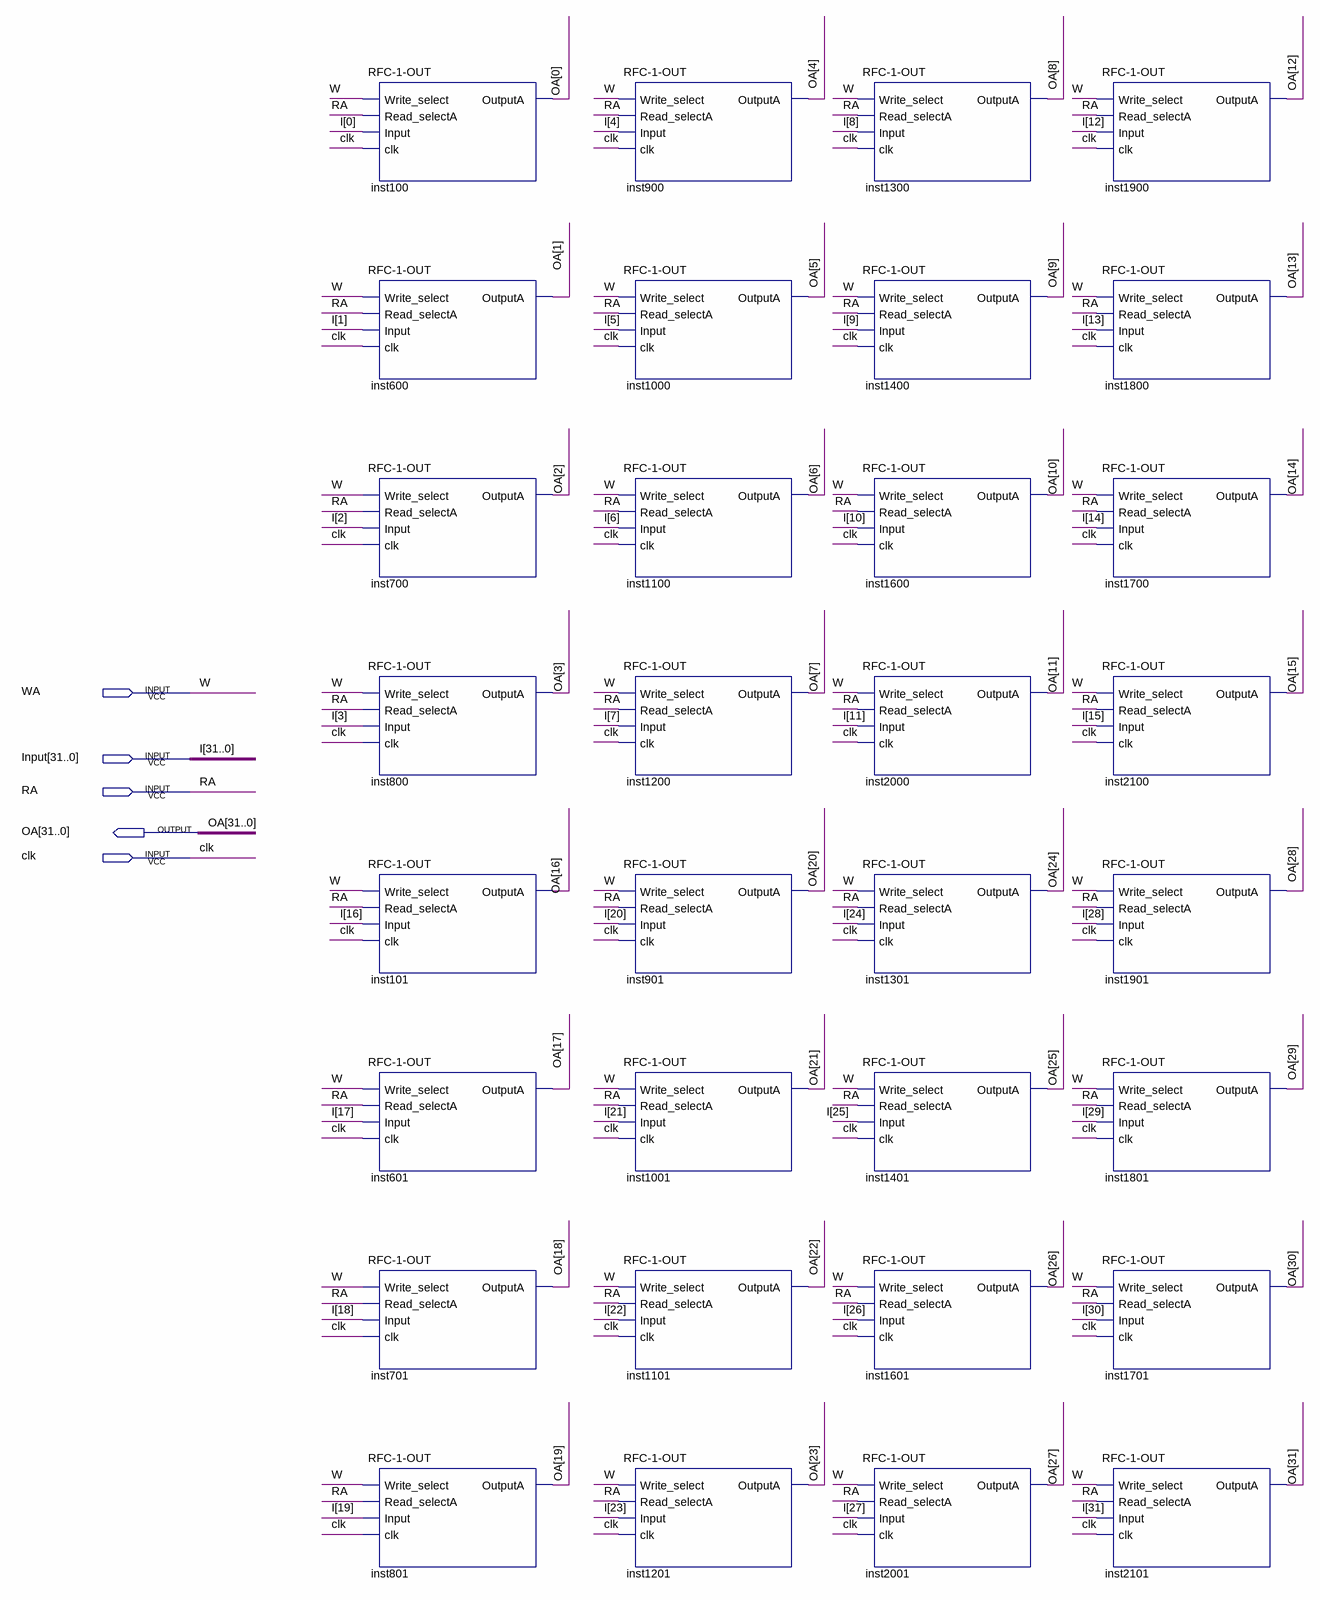
[diagram p0: schematic sheet]
// Quartus schematic RFC-1-OUT-32bits.bdf as structural Verilog: 32 symbols, 5 pins
module \RFC-1-OUT-32bits  (
  input  WA,
  input  [31:0] Input,
  input  RA,
  input  clk,
  output [31:0] OA
);

  \RFC-1-OUT  inst100 (.Write_select(WA), .Read_selectA(RA), .Input(Input[0]), .clk(clk), .OutputA(OA[0]));
  \RFC-1-OUT  inst600 (.Write_select(WA), .Read_selectA(RA), .Input(Input[1]), .clk(clk), .OutputA(OA[1]));
  \RFC-1-OUT  inst700 (.Write_select(WA), .Read_selectA(RA), .Input(Input[2]), .clk(clk), .OutputA(OA[2]));
  \RFC-1-OUT  inst800 (.Write_select(WA), .Read_selectA(RA), .Input(Input[3]), .clk(clk), .OutputA(OA[3]));
  \RFC-1-OUT  inst101 (.Write_select(WA), .Read_selectA(RA), .Input(Input[16]), .clk(clk), .OutputA(OA[16]));
  \RFC-1-OUT  inst601 (.Write_select(WA), .Read_selectA(RA), .Input(Input[17]), .clk(clk), .OutputA(OA[17]));
  \RFC-1-OUT  inst701 (.Write_select(WA), .Read_selectA(RA), .Input(Input[18]), .clk(clk), .OutputA(OA[18]));
  \RFC-1-OUT  inst801 (.Write_select(WA), .Read_selectA(RA), .Input(Input[19]), .clk(clk), .OutputA(OA[19]));
  \RFC-1-OUT  inst900 (.Write_select(WA), .Read_selectA(RA), .Input(Input[4]), .clk(clk), .OutputA(OA[4]));
  \RFC-1-OUT  inst1000 (.Write_select(WA), .Read_selectA(RA), .Input(Input[5]), .clk(clk), .OutputA(OA[5]));
  \RFC-1-OUT  inst1100 (.Write_select(WA), .Read_selectA(RA), .Input(Input[6]), .clk(clk), .OutputA(OA[6]));
  \RFC-1-OUT  inst1200 (.Write_select(WA), .Read_selectA(RA), .Input(Input[7]), .clk(clk), .OutputA(OA[7]));
  \RFC-1-OUT  inst901 (.Write_select(WA), .Read_selectA(RA), .Input(Input[20]), .clk(clk), .OutputA(OA[20]));
  \RFC-1-OUT  inst1001 (.Write_select(WA), .Read_selectA(RA), .Input(Input[21]), .clk(clk), .OutputA(OA[21]));
  \RFC-1-OUT  inst1101 (.Write_select(WA), .Read_selectA(RA), .Input(Input[22]), .clk(clk), .OutputA(OA[22]));
  \RFC-1-OUT  inst1201 (.Write_select(WA), .Read_selectA(RA), .Input(Input[23]), .clk(clk), .OutputA(OA[23]));
  \RFC-1-OUT  inst1300 (.Write_select(WA), .Read_selectA(RA), .Input(Input[8]), .clk(clk), .OutputA(OA[8]));
  \RFC-1-OUT  inst1400 (.Write_select(WA), .Read_selectA(RA), .Input(Input[9]), .clk(clk), .OutputA(OA[9]));
  \RFC-1-OUT  inst1600 (.Write_select(WA), .Read_selectA(RA), .Input(Input[10]), .clk(clk), .OutputA(OA[10]));
  \RFC-1-OUT  inst2000 (.Write_select(WA), .Read_selectA(RA), .Input(Input[11]), .clk(clk), .OutputA(OA[11]));
  \RFC-1-OUT  inst1301 (.Write_select(WA), .Read_selectA(RA), .Input(Input[24]), .clk(clk), .OutputA(OA[24]));
  \RFC-1-OUT  inst1401 (.Write_select(WA), .Read_selectA(RA), .Input(Input[25]), .clk(clk), .OutputA(OA[25]));
  \RFC-1-OUT  inst1601 (.Write_select(WA), .Read_selectA(RA), .Input(Input[26]), .clk(clk), .OutputA(OA[26]));
  \RFC-1-OUT  inst2001 (.Write_select(WA), .Read_selectA(RA), .Input(Input[27]), .clk(clk), .OutputA(OA[27]));
  \RFC-1-OUT  inst1900 (.Write_select(WA), .Read_selectA(RA), .Input(Input[12]), .clk(clk), .OutputA(OA[12]));
  \RFC-1-OUT  inst1800 (.Write_select(WA), .Read_selectA(RA), .Input(Input[13]), .clk(clk), .OutputA(OA[13]));
  \RFC-1-OUT  inst1700 (.Write_select(WA), .Read_selectA(RA), .Input(Input[14]), .clk(clk), .OutputA(OA[14]));
  \RFC-1-OUT  inst2100 (.Write_select(WA), .Read_selectA(RA), .Input(Input[15]), .clk(clk), .OutputA(OA[15]));
  \RFC-1-OUT  inst1901 (.Write_select(WA), .Read_selectA(RA), .Input(Input[28]), .clk(clk), .OutputA(OA[28]));
  \RFC-1-OUT  inst1801 (.Write_select(WA), .Read_selectA(RA), .Input(Input[29]), .clk(clk), .OutputA(OA[29]));
  \RFC-1-OUT  inst1701 (.Write_select(WA), .Read_selectA(RA), .Input(Input[30]), .clk(clk), .OutputA(OA[30]));
  \RFC-1-OUT  inst2101 (.Write_select(WA), .Read_selectA(RA), .Input(Input[31]), .clk(clk), .OutputA(OA[31]));

  // Other names for the same wires on the sheet: I[31:0] = Input; W = WA
endmodule
